# Altium schematic sheet Motor Connection.SchDoc: Motor Connection
size A4; DocumentNumber: 12; SheetNumber: 12; SheetTotal: 51
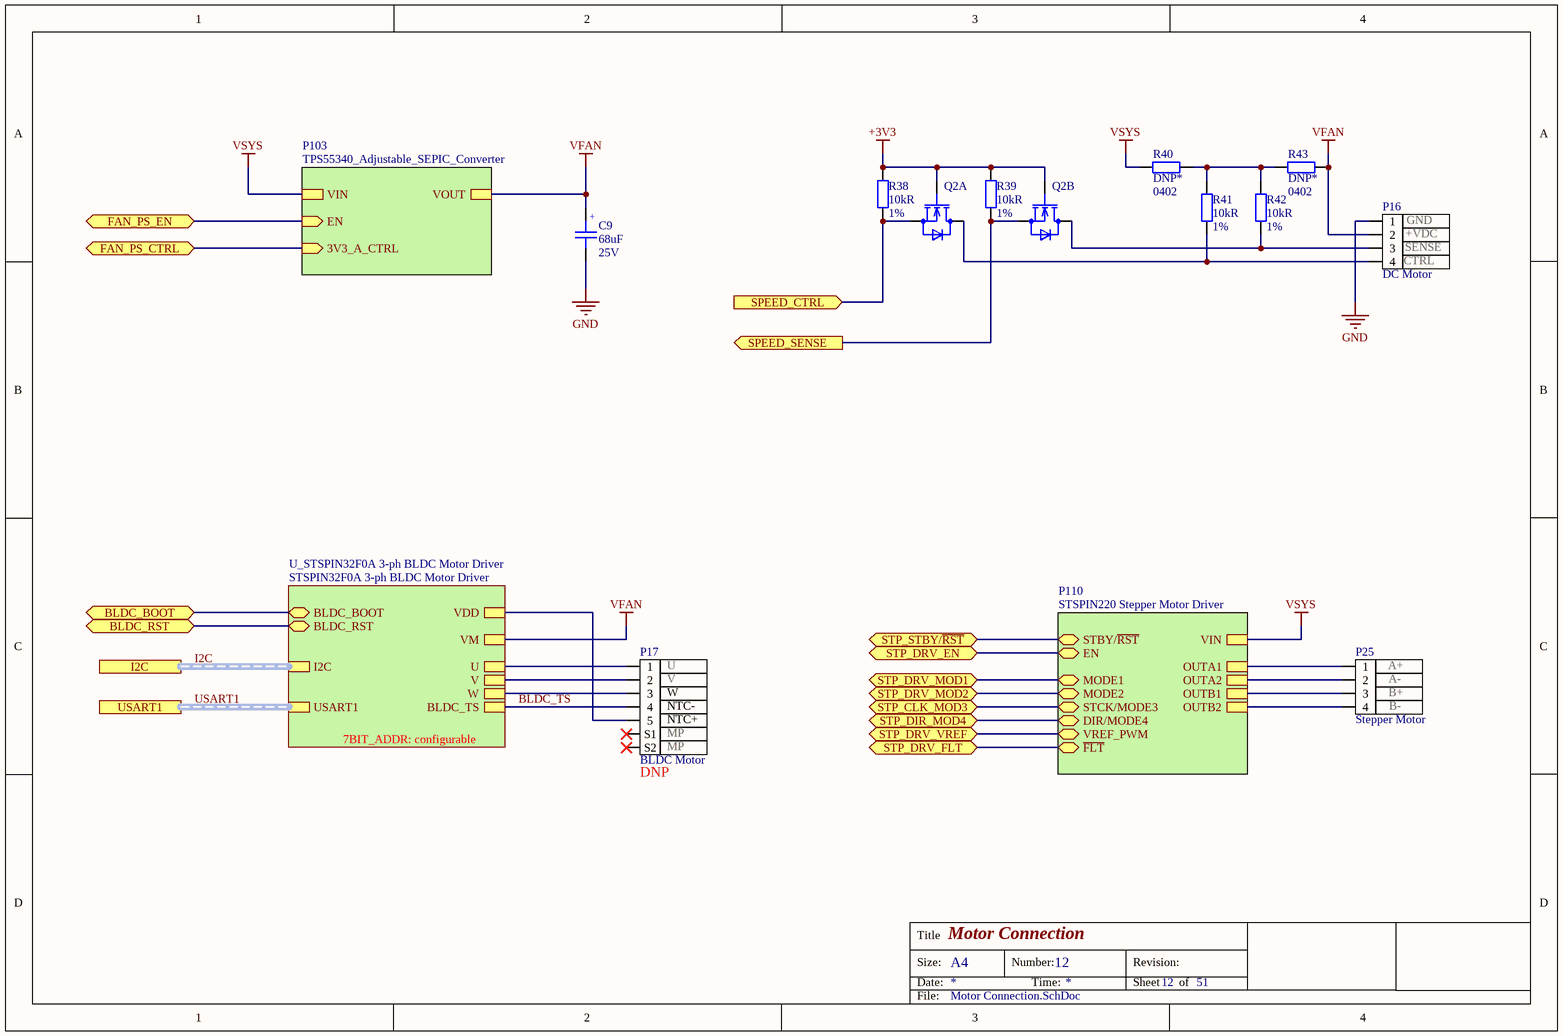
[diagram p0: Motor Connection.SchDoc]

## Parts
C9  Capacitance: 68uF  Rated Voltage: 25V  [CT7343]  (hidden comment: CAP TANT 68UF 20% 25V 2917)
P16  DC Motor  pin_1: GND  pin_2: +VDC  pin_3: SENSE  pin_4: CTRL  [CONN_JST_B4B-ZR-SM4-TF(LF)(SN)]
P17  BLDC Motor  pin_1: U  pin_2: V  pin_MP1: MP  pin_3: W  pin_4: NTC-  pin_5: NTC+  DNP Status: DNP  [CONN_JST_B5B-PH-K-S(LF)(SN)]  (no BOM)
P25  Stepper Motor  pin_1: A+  pin_2: A-  pin_3: B+  pin_4: B-  [CONN_JST_BM04B-NSHSS-TBT]
Q2  DMN32D2LV-7  [SON_400UV-7_DIO]  (value not drawn)  (parts A,B of 2)
R38  Resistance: 10kR  Tolerance: 1%  [R0402]  (hidden comment: RES SMD 10K OHM 1% 1/16W 0402)
R39  Resistance: 10kR  Tolerance: 1%  [R0402]  (hidden comment: RES SMD 10K OHM 1% 1/16W 0402)
R40  DNP*  Case/Package: 0402  [R0402]  (no BOM)
R41  Resistance: 10kR  Tolerance: 1%  [R0402]  (hidden comment: RES SMD 10K OHM 1% 1/16W 0402)
R42  Resistance: 10kR  Tolerance: 1%  [R0402]  (hidden comment: RES SMD 10K OHM 1% 1/16W 0402)
R43  DNP*  Case/Package: 0402  [R0402]  (no BOM)

## Sub-sheets
P103 = TPS55340_Adjustable_SEPIC_Converter: EN (in), VIN, VOUT, 3V3_A_CTRL (in)
P110 = STSPIN220 Stepper Motor Driver: MODE1 (bidir), OUTB1, VREF_PWM (bidir), EN (bidir), MODE2 (bidir), OUTB2, OUTA2, DIR/MODE4 (bidir), STCK/MODE3 (bidir), ~{FLT} (bidir), STBY/~{RST} (bidir), OUTA1, VIN
U_STSPIN32F0A 3-ph BLDC Motor Driver = STSPIN32F0A 3-ph BLDC Motor Driver: U, V, W, VM, BLDC_TS, VDD, BLDC_BOOT (bidir), BLDC_RST (bidir), I2C (harness I2C), USART1 (harness UART)  | 7BIT_ADDR: configurable

## Ports
BLDC_BOOT (bidir), BLDC_RST (bidir), FAN_PS_CTRL (bidir), FAN_PS_EN (bidir), I2C (harness I2C), SPEED_CTRL (in), SPEED_SENSE (out), STP_CLK_MOD3 (bidir), STP_DIR_MOD4 (bidir), STP_DRV_EN (bidir), STP_DRV_FLT (bidir), STP_DRV_MOD1 (bidir), STP_DRV_MOD2 (bidir), STP_DRV_VREF (bidir), STP_STBY/~{RST} (bidir), USART1 (harness UART)

## Nets
+3V3: Q2.2(G) Q2.5(G) R38.1 R39.1
GND: C9.2 P16.1
VFAN: C9.1 P16.2 R43.2 ; sheet P103/VOUT, sheet U_STSPIN32F0A 3-ph BLDC Motor Driver/VM
VSYS: R40.1 ; sheet P110/VIN, sheet P103/VIN
BLDC_BOOT: port BLDC_BOOT, sheet U_STSPIN32F0A 3-ph BLDC Motor Driver/BLDC_BOOT
BLDC_RST: port BLDC_RST, sheet U_STSPIN32F0A 3-ph BLDC Motor Driver/BLDC_RST
BLDC_TS: P17.4 ; sheet U_STSPIN32F0A 3-ph BLDC Motor Driver/BLDC_TS
FAN_PS_CTRL: port FAN_PS_CTRL, sheet P103/3V3_A_CTRL
FAN_PS_EN: port FAN_PS_EN, sheet P103/EN
SPEED_CTRL: Q2.1(S) R38.2 ; port SPEED_CTRL
SPEED_SENSE: Q2.4(S) R39.2 ; port SPEED_SENSE
STP_CLK_MOD3: port STP_CLK_MOD3, sheet P110/STCK/MODE3
STP_DIR_MOD4: port STP_DIR_MOD4, sheet P110/DIR/MODE4
STP_DRV_EN: port STP_DRV_EN, sheet P110/EN
STP_DRV_FLT: port STP_DRV_FLT, sheet P110/~{FLT}
STP_DRV_MOD1: port STP_DRV_MOD1, sheet P110/MODE1
STP_DRV_MOD2: port STP_DRV_MOD2, sheet P110/MODE2
STP_DRV_VREF: port STP_DRV_VREF, sheet P110/VREF_PWM
STP_STBY/~{RST}: port STP_STBY/~{RST}, sheet P110/STBY/~{RST}
NetP16_3: P16.3 Q2.3(D) R42.2
NetP16_4: P16.4 Q2.6(D) R41.2
NetP17_1: P17.1 ; sheet U_STSPIN32F0A 3-ph BLDC Motor Driver/U
NetP17_2: P17.2 ; sheet U_STSPIN32F0A 3-ph BLDC Motor Driver/V
NetP17_3: P17.3 ; sheet U_STSPIN32F0A 3-ph BLDC Motor Driver/W
NetP17_5: P17.5 ; sheet U_STSPIN32F0A 3-ph BLDC Motor Driver/VDD
NetP25_1: P25.1 ; sheet P110/OUTA1
NetP25_2: P25.2 ; sheet P110/OUTA2
NetP25_3: P25.3 ; sheet P110/OUTB1
NetP25_4: P25.4 ; sheet P110/OUTB2
NetR40_2: R40.2 R41.1 R42.1 R43.1

Not connected (* = marked no-connect by the designer): P17 S1* S2*

## Buses and harness runs
harness I2C = port I2C = sheet U_STSPIN32F0A 3-ph BLDC Motor Driver/I2C
harness USART1 = port USART1 = sheet U_STSPIN32F0A 3-ph BLDC Motor Driver/USART1

## Notes on the sheet
- Title
- Size:
- Date:
- A4
- Number:
- Time:
- Revision:
- Sheet
- of
- File:
- (in symbol CAP TANT 68UF 20% 25V 2917) +

## Library data of the parts
C9 = CAP TANT 68UF 20% 25V 2917: 68 µF Molded Tantalum Capacitors 25 V 2917 (7343 Metric) 200mOhm; Manufacturer: KEMET; Manufacturer Part Number: T495X686M025ATE200; Dissipation Factor: 10%; Endurance: 2000h; Capacitance Tolerance: +/-20%; Supplier 1: Digi-Key; Packaging: Tape and Reel; ComponentLink1URL: https://www.digikey.com/en/products/detail/kemet/T495X686M025ATE200/3760589; ComponentLink1Description: Manufacturer; Supplier Part Number 1: 399-10314-2-ND; Height: 4.3mm; ComponentLink2URL: https://www.digikey.com/en/products/detail/kemet/T495X686M025ATE200/3760589; ComponentLink2Description: Datasheet; Mounting Technology: SMT; Operating Temperature: -55 to +125degC; Mount: Surface Mount
P16 = CONN HEADER SMD 4POS 1.5MM: Connector Header Surface Mount 4 position 0.059" (1.50mm); Manufacturer: JST; Manufacturer Part Number: B4B-ZR-SM4-TFT(LF)(SN); Body Plating: Tin; Number of Positions: 4; Connector Type: Header,Male Pin; Voltage Rating: 50V; Contact Resistance: 30mR; Max Current Rating: 1A; Insulation Resistance: 500MR; Gender: Male; Pitch: 1.5mm; Panel Thickness: 3.5mm; Supplier 1: Arrow; Stock 1: 0; Mount: SMD; Number of Pins: 4; Color: White; Contact Plating: Tin,Copper; Contact Material: Brass,Tin,Copper; Material: Nylon; Housing Color: Beige; Housing Material: Polyamide; Contact Shape: Circular; Insulation Material: Nylon; Insulation Color: Natural; Min Operating Temperature: -25°C; Max Operating Temperature: 85°C; Packaging: Bulk; Number of Rows: 1; Termination: Solder; Voltage Rating (DC): 50V; Current Rating: 1A; Voltage Rating (AC): 50V; Fastening Type: Detent; Max Voltage Rating (AC): 50V; Max Voltage Rating (DC): 50V; Number of Contacts: 4; Length: 7.5mm; Height: 7.2mm; Width: 3.5mm; Depth: 6mm; Lead Pitch: 1.5mm; Contact Mating Length: 0.094inch; REACH SVHC: No SVHC; Lead Free: Lead Free; Flammability Rating: UL94 V-0; ComponentLink1URL: https://www.digikey.com/en/products/detail/jst-sales-america-inc/B4B-ZR-SM4-TFT-LF-SN/2650576; ComponentLink1Description: https://www.digikey.com/en/products/detail/jst-sales-america-inc/B4B-ZR-SM4-TFT-LF-SN/2650576; Supplier Part Number 1: B4B-ZR-SM4-TFT(LF)(SN)
P17 = CONN HEADER VERT 5POS 2MM: Connector Header Through Hole 5 position 0.079" (2.00mm); Manufacturer: JST; Manufacturer Part Number: B5B-PH-K-S(LF)(SN); Number of Positions: 5; Connector Type: Male Pin; Contact Resistance: 20mR; Current Rating: 2A; Voltage Rating: 100V; Gender: Male; Pitch: 2mm; Supplier 1: Digi-Key; Stock 1: 0; Mount: Surface Mount; Color: Natural; Contact Plating: Tin,Copper; Contact Material: Brass,Tin; Housing Material: Polyamide; Housing Color: Beige; Min Operating Temperature: -25°C; Max Operating Temperature: 85°C; Number of Rows: 1; Packaging: Tape and Reel; Series: ZH; Contact Type: Male Pin; Termination: Solder; Max Current Rating: 2A; Fastening Type: Detent; Max Voltage Rating (AC): 100V; Number of Contacts: 5; Orientation: Right Angle; Length: 11.9mm; Width: 3.5mm; Height: 8mm; Depth: 6.5mm; REACH SVHC: Unknown; Lead Free: Lead Free; ComponentLink1URL: https://www.digikey.com/en/products/detail/jst-sales-america-inc/B5B-PH-K-S-LF-SN/926614; ComponentLink1Description: https://www.digikey.com/en/products/detail/jst-sales-america-inc/B5B-PH-K-S-LF-SN/926614; Supplier Part Number 1: 455-1707-ND; pin_MP2: MP
P25 = CONN HEADER SMD 4POS 1MM: Connector Header Surface Mount 4 position 0.039" (1.00mm); Manufacturer: JST; Manufacturer Part Number: BM04B-NSHSS-TBT(LF)(SN); Body Plating: Tin; Number of Positions: 4; Connector Type: Header,Male Pin; Voltage Rating: 50V; Contact Resistance: 30mR; Max Current Rating: 1A; Insulation Resistance: 100MR; Gender: Male; Pitch: 1mm; Stock 1: 0; Mount: SMD; Number of Pins: 4; Color: White; Contact Plating: Tin,Copper; Contact Material: Brass,Tin,Copper; Material: Nylon; Housing Material: Polyamide; Contact Shape: Circular; Insulation Material: Nylon; Insulation Color: Natural; Min Operating Temperature: -25°C; Max Operating Temperature: 85°C; Packaging: Bulk; Number of Rows: 1; Termination: Solder; Voltage Rating (DC): 50V; Current Rating: 1A; Voltage Rating (AC): 50V; Fastening Type: Detent; Max Voltage Rating (AC): 50V; Max Voltage Rating (DC): 50V; Number of Contacts: 4; Orientation: Right Angle; Lead Pitch: 1mm; REACH SVHC: No SVHC; Flammability Rating: UL94 V-0; ComponentLink1URL: https://www.digikey.com/en/products/detail/jst-sales-america-inc/BM04B-NSHSS-TBT-LF-SN/3313642; ComponentLink1Description: https://www.digikey.com/en/products/detail/jst-sales-america-inc/BM04B-NSHSS-TBT-LF-SN/3313642; Supplier Part Number 1: BM04B-NSHSS-TBT(LF)(SN)
Q2 = ARRAY MOSFET 2N-CH 30V 0.4A SOT-563: Mosfet Array 2 N-Channel (Dual) 30V 400mA 400mW Surface Mount SOT-563; Manufacturer: Diodes; Gate to Source Voltage (Vgs): 10V; Rds On Max: 1.2R; Input Capacitance: 39pF; Number of Channels: 2; Supplier 1: Digi-Key; Manufacturer Part Number: DMN32D2LV-7; Stock 1: 141366; Pricing 1: 1=0.39, 10=0.338, 25=0.3152, 100=0.234, 500=0.1827, 1000=0.1485 (USD); Mount: Surface Mount; Min Operating Temperature: -55°C; Max Operating Temperature: 150°C; Continuous Drain Current (ID): 400mA; Package Quantity: 3000; Packaging: Tape and Reel; Drain to Source Voltage (Vdss): 30V; Max Power Dissipation: 400mW; Drain to Source Breakdown Voltage: 30V; Drain to Source Resistance: 1.2R; Element Configuration: Dual; FET Type: 2 N-Channel; Length: 1.6mm; Height: 0.6mm; Width: 1.2mm; Radiation Hardening: No; REACH SVHC: No SVHC; ComponentLink1URL: https://www.diodes.com/assets/Datasheets/ds31121.pdf?src-supplier=Digi-Key; ComponentLink1Description: https://www.diodes.com/assets/Datasheets/ds31121.pdf?src-supplier=Digi-Key; ComponentLink2URL: http://www.mouser.com/ds/2/115/ds31121-89496.pdf?src-supplier=Mouser; ComponentLink2Description: http://www.mouser.com/ds/2/115/ds31121-89496.pdf?src-supplier=Mouser; ComponentLink3URL: http://www.diodes.com///datasheets/ds31121.pdf?src-supplier=Avnet; ComponentLink3Description: http://www.diodes.com///datasheets/ds31121.pdf?src-supplier=Avnet; Supplier Part Number 1: DMN32D2LV-7DICT-ND; Case/Package: SOT-563; Weight: 0.000106oz; Polarity: N-CHANNEL; Series: -
R38 R39 R41 R42 = RES SMD 10K OHM 1% 1/16W 0402: 10 kOhms ±1% 0.063W, 1/16W Chip Resistor 0402 (1005 Metric) Moisture Resistant Thick Film; Manufacturer Part Number: RC0402FR-0710KP; Manufacturer: Yageo; Temperature Coefficient: 150ppm/°C; Max Power Dissipation: 63mW; Supplier 1: Digi-Key; Stock 1: 839368; Pricing 1: 1=0.1, 10=0.035, 100=0.014, 1000=0.0063, 2500=0.0055, 5000=0.0045 (USD); Case Code (Imperial): 0402; Case Code (Metric): 1005; Min Operating Temperature: -55°C; Max Operating Temperature: 155°C; Composition: Thick Film; Packaging: Tape and Reel; Number of Terminations: 2; Length: 0.039inch; Height: 0.016inch; Width: 0.02inch; ComponentLink1URL: http://www.yageo.com/NewPortal/yageodocoutput?fileName=/pdf/R-Chip/PYu-RC_51_RoHS_P_0.pdf&src-supplier=Digi-Key; ComponentLink1Description: http://www.yageo.com/NewPortal/yageodocoutput?fileName=/pdf/R-Chip/PYu-RC_51_RoHS_P_0.pdf&src-supplier=Digi-Key; Supplier Part Number 1: YAG1249CT-ND; Case/Package: 0402; Features: Moisture Resistant; Mount: Surface Mount
R40 R43 = RES SMD NO BOM 0402: Placeholder for a 0402 resistor